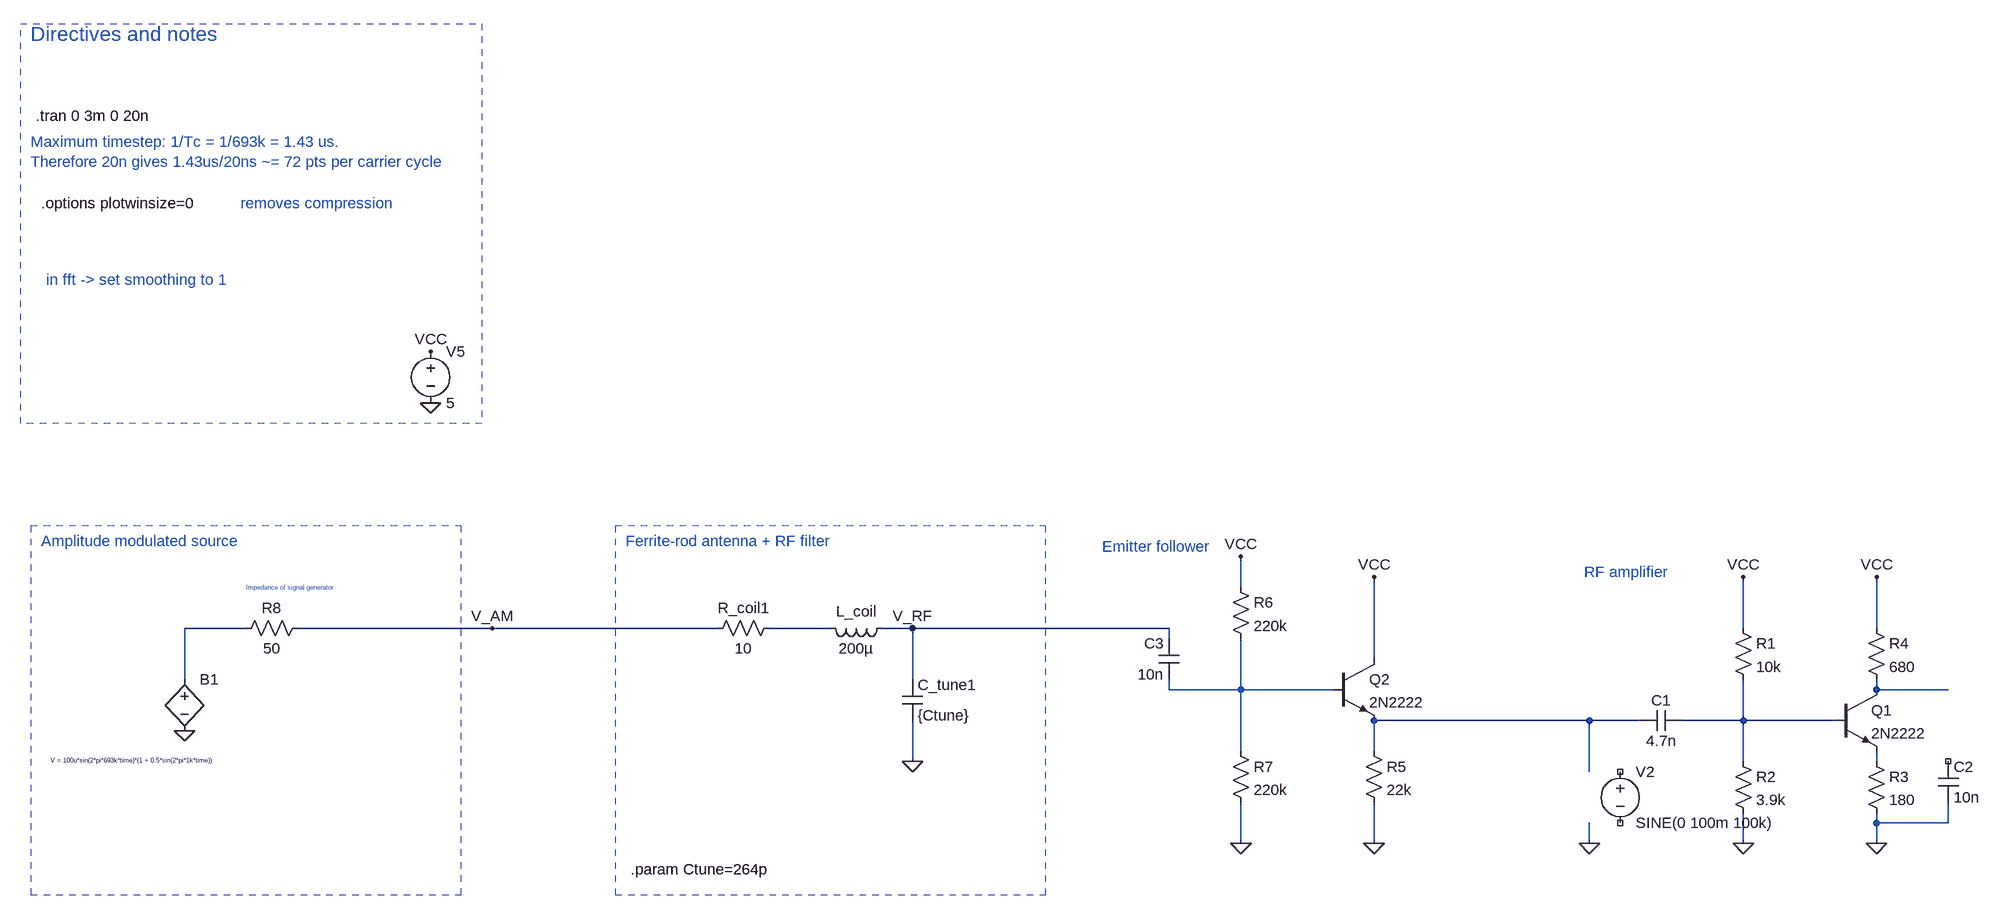
[diagram p0: schematic radio.asc]
radio.asc, the LTspice schematic file:
Version 4.1
SHEET 1 3304 1388
WIRE 2144 -64 2144 -112
WIRE 592 0 496 0
WIRE 976 0 672 0
WIRE 1328 0 976 0
WIRE 1504 0 1408 0
WIRE 1632 0 1584 0
WIRE 2032 0 1632 0
WIRE 2928 0 2928 -80
WIRE 3136 0 3136 -80
WIRE 2032 16 2032 0
WIRE 2352 48 2352 -80
WIRE 496 80 496 0
WIRE 1632 80 1632 0
WIRE 2032 96 2032 80
WIRE 2144 96 2144 16
WIRE 2144 96 2032 96
WIRE 2288 96 2144 96
WIRE 3136 96 3136 80
WIRE 3248 96 3136 96
WIRE 2688 144 2352 144
WIRE 2768 144 2688 144
WIRE 2928 144 2928 80
WIRE 2928 144 2832 144
WIRE 3072 144 2928 144
WIRE 2144 192 2144 96
WIRE 2352 192 2352 144
WIRE 1632 208 1632 144
WIRE 2928 208 2928 144
WIRE 3136 208 3136 192
WIRE 2688 224 2688 144
WIRE 3136 304 3136 288
WIRE 3248 304 3248 272
WIRE 3248 304 3136 304
WIRE 2144 336 2144 272
WIRE 2352 336 2352 272
WIRE 2688 336 2688 304
WIRE 2928 336 2928 288
WIRE 3136 336 3136 304
FLAG 496 160 0
FLAG 1632 208 0
FLAG 976 0 V_AM
FLAG 1632 0 V_RF
FLAG 2688 336 0
FLAG 2928 336 0
FLAG 3136 336 0
FLAG 2352 336 0
FLAG 880 -352 0
FLAG 880 -432 VCC
FLAG 2928 -80 VCC
FLAG 3136 -80 VCC
FLAG 2352 -80 VCC
FLAG 2144 336 0
FLAG 2144 -112 VCC
SYMBOL bv 496 64 R0
WINDOW 3 -209 142 Left 0
SYMATTR InstName B1
SYMATTR Value V = 100u*sin(2*pi*693k*time)*(1 + 0.5*sin(2*pi*1k*time))
+
200u*sin(2*pi*774k*time)*(1 + 0.4*sin(2*pi*700*time))
+
50u*sin(2*pi*855k*time)*(1 + 0.6*sin(2*pi*1.3k*time))
+
10u*white(time*1e6)
SYMBOL res 1424 -16 R90
WINDOW 0 0 56 VBottom 2
WINDOW 3 32 56 VTop 2
SYMATTR InstName R_coil1
SYMATTR Value 10
SYMBOL ind 1600 -16 R90
WINDOW 0 5 56 VBottom 2
WINDOW 3 32 56 VTop 2
SYMATTR InstName L_coil
SYMATTR Value 200µ
SYMATTR SpiceLine Rser=1m
SYMBOL cap 1616 80 R0
SYMATTR InstName C_tune1
SYMATTR Value {Ctune}
SYMBOL npn 3072 96 R0
SYMATTR InstName Q1
SYMATTR Value 2N2222
SYMBOL voltage 2736 208 R0
WINDOW 123 0 0 Left 0
WINDOW 39 0 0 Left 0
SYMATTR InstName V2
SYMATTR Value SINE(0 100m 100k)
SYMBOL cap 2832 128 R90
WINDOW 0 0 32 VBottom 2
WINDOW 3 32 32 VTop 2
SYMATTR InstName C1
SYMATTR Value 4.7n
SYMBOL res 2912 -16 R0
SYMATTR InstName R1
SYMATTR Value 10k
SYMBOL res 2912 192 R0
SYMATTR InstName R2
SYMATTR Value 3.9k
SYMBOL res 3120 192 R0
SYMATTR InstName R3
SYMATTR Value 180
SYMBOL res 3120 -16 R0
SYMATTR InstName R4
SYMATTR Value 680
SYMBOL cap 3232 208 R0
SYMATTR InstName C2
SYMATTR Value 10n
SYMBOL npn 2288 48 R0
SYMATTR InstName Q2
SYMATTR Value 2N2222
SYMBOL res 2336 176 R0
SYMATTR InstName R5
SYMATTR Value 22k
SYMBOL voltage 880 -448 R0
WINDOW 123 0 0 Left 0
WINDOW 39 0 0 Left 0
SYMATTR InstName V5
SYMATTR Value 5
SYMBOL res 2128 -80 R0
SYMATTR InstName R6
SYMATTR Value 220k
SYMBOL res 2128 176 R0
SYMATTR InstName R7
SYMATTR Value 220k
SYMBOL cap 2048 80 R180
WINDOW 0 24 56 Left 2
WINDOW 3 24 8 Left 2
SYMATTR InstName C3
SYMATTR Value 10n
SYMBOL res 688 -16 R90
WINDOW 0 0 56 VBottom 2
WINDOW 3 32 56 VTop 2
SYMATTR InstName R8
SYMATTR Value 50
TEXT 264 -800 Left 2 !.tran 0 3m 0 20n
TEXT 256 -760 Left 2 ;Maximum timestep: 1/Tc = 1/693k = 1.43 us. \nTherefore 20n gives 1.43us/20ns ~= 72 pts per carrier cycle
TEXT 272 -664 Left 2 !.options plotwinsize=0
TEXT 256 -928 Left 3 ;Directives and notes
TEXT 584 -664 Left 2 ;removes compression
TEXT 280 -544 Left 2 ;in fft -> set smoothing to 1
TEXT 272 -136 Left 2 ;Amplitude modulated source
TEXT 1192 376 Left 2 !.param Ctune=264p
TEXT 1184 -136 Left 2 ;Ferrite-rod antenna + RF filter
TEXT 2680 -88 Left 2 ;RF amplifier
TEXT 1928 -128 Left 2 ;Emitter follower
TEXT 592 -64 Left 0 ;Impedance of signal generator
RECTANGLE Normal 960 -320 240 -944 2
RECTANGLE Normal 928 -160 256 416 2
RECTANGLE Normal 1840 -160 1168 416 2

The netlist it stands for:
* radio.asc
B1 N001 0 V = 100u*sin(2*pi*693k*time)*(1 + 0.5*sin(2*pi*1k*time))
R_coil1 N002 V_AM 10
L_coil V_RF N002 200µ Rser=1m
C_tune1 V_RF 0 {Ctune}
Q1 N004 N006 N007 0 2N2222
V2 NC_01 NC_02 SINE(0 100m 100k)
C1 N006 N005 4.7n
R1 VCC N006 10k
R2 N006 0 3.9k
R3 N007 0 180
R4 VCC N004 680
C2 NC_03 0 10n
Q2 VCC N003 N005 0 2N2222
R5 N005 0 22k
V5 VCC 0 5
R6 VCC N003 220k
R7 N003 0 220k
C3 N003 V_RF 10n
R8 V_AM N001 50
.model NPN NPN
.model PNP PNP
.lib standard.bjt
.tran 0 3m 0 20n
* Maximum timestep: 1/Tc = 1/693k = 1.43 us.
* Therefore 20n gives 1.43us/20ns ~= 72 pts per carrier cycle
.options plotwinsize=0
* Directives and notes
* removes compression
* in fft -> set smoothing to 1
* Amplitude modulated source
.param Ctune=264p
* Ferrite-rod antenna + RF filter
* RF amplifier
* Emitter follower
* Impedance of signal generator
.backanno
.end